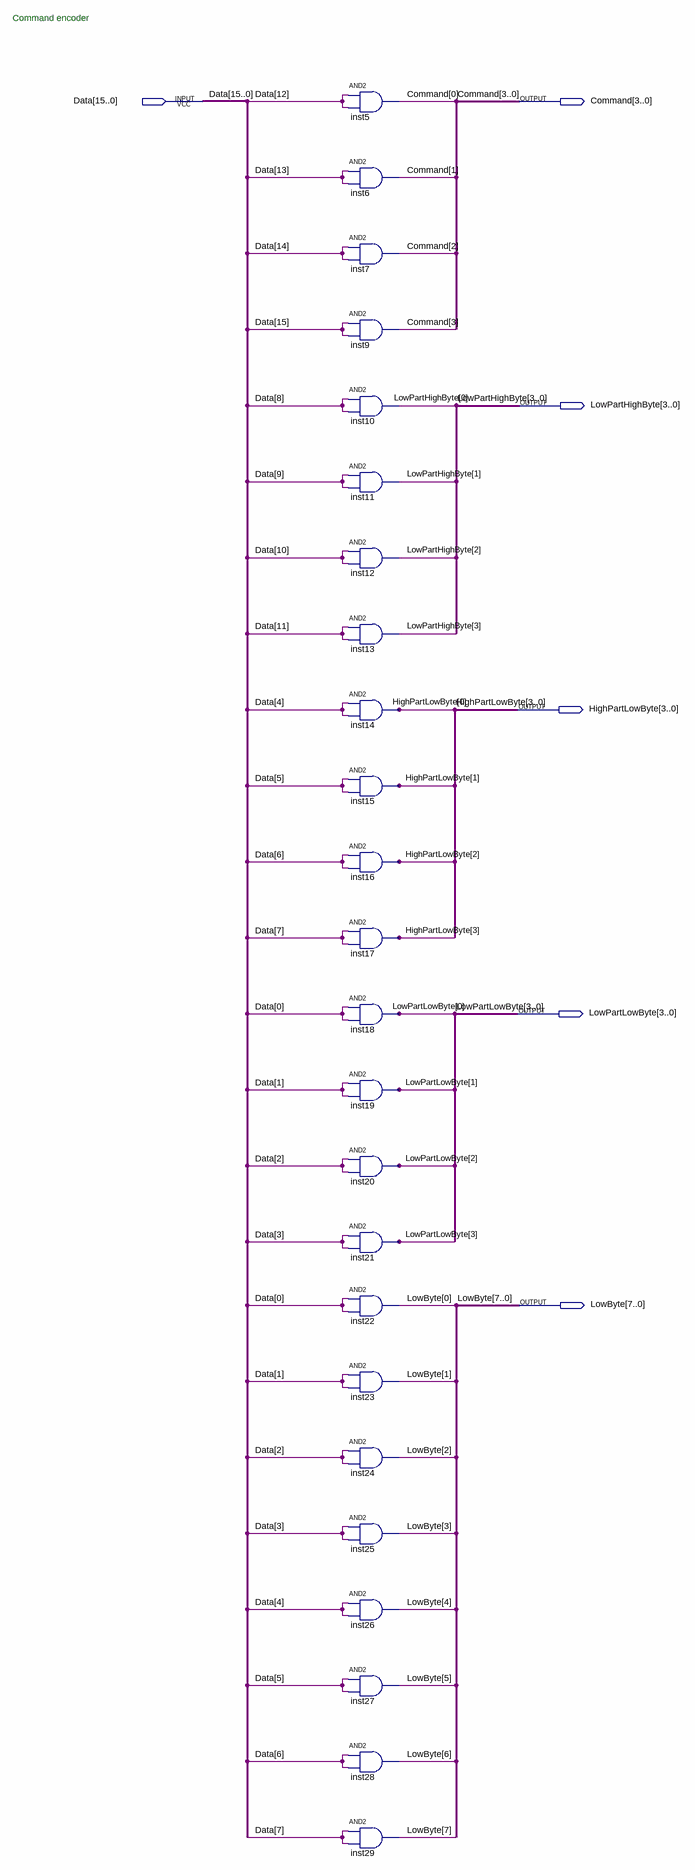
[diagram p0: schematic sheet]
// Quartus schematic CommandEncoder.bdf as structural Verilog: 24 symbols, 6 pins
module CommandEncoder (
  input  [15:0] Data,
  output [3:0] Command,
  output [3:0] LowPartHighByte,
  output [3:0] HighPartLowByte,
  output [3:0] LowPartLowByte,
  output [7:0] LowByte
);

  and inst5 (Command[0], Data[12], Data[12]);
  and inst6 (Command[1], Data[13], Data[13]);
  and inst7 (Command[2], Data[14], Data[14]);
  and inst9 (Command[3], Data[15], Data[15]);
  and inst10 (LowPartHighByte[0], Data[8], Data[8]);
  and inst11 (LowPartHighByte[1], Data[9], Data[9]);
  and inst12 (LowPartHighByte[2], Data[10], Data[10]);
  and inst13 (LowPartHighByte[3], Data[11], Data[11]);
  and inst14 (HighPartLowByte[0], Data[4], Data[4]);
  and inst15 (HighPartLowByte[1], Data[5], Data[5]);
  and inst16 (HighPartLowByte[2], Data[6], Data[6]);
  and inst17 (HighPartLowByte[3], Data[7], Data[7]);
  and inst18 (LowPartLowByte[0], Data[0], Data[0]);
  and inst19 (LowPartLowByte[1], Data[1], Data[1]);
  and inst20 (LowPartLowByte[2], Data[2], Data[2]);
  and inst21 (LowPartLowByte[3], Data[3], Data[3]);
  and inst22 (LowByte[0], Data[0], Data[0]);
  and inst23 (LowByte[1], Data[1], Data[1]);
  and inst24 (LowByte[2], Data[2], Data[2]);
  and inst25 (LowByte[3], Data[3], Data[3]);
  and inst26 (LowByte[4], Data[4], Data[4]);
  and inst27 (LowByte[5], Data[5], Data[5]);
  and inst28 (LowByte[6], Data[6], Data[6]);
  and inst29 (LowByte[7], Data[7], Data[7]);

  // Notes on the sheet:
  //   Command encoder
endmodule
